# Altium schematic sheet Main.SchDoc
size A3; Author: ALP Electronics; CompanyName: ALP Electronics; DrawnBy: Caner Alp; Engineer: Caner Alp; Organization: ALP Electronics; Address2: Västerås; Address4: Sweden; SheetNumber: 1; SheetTotal: 3
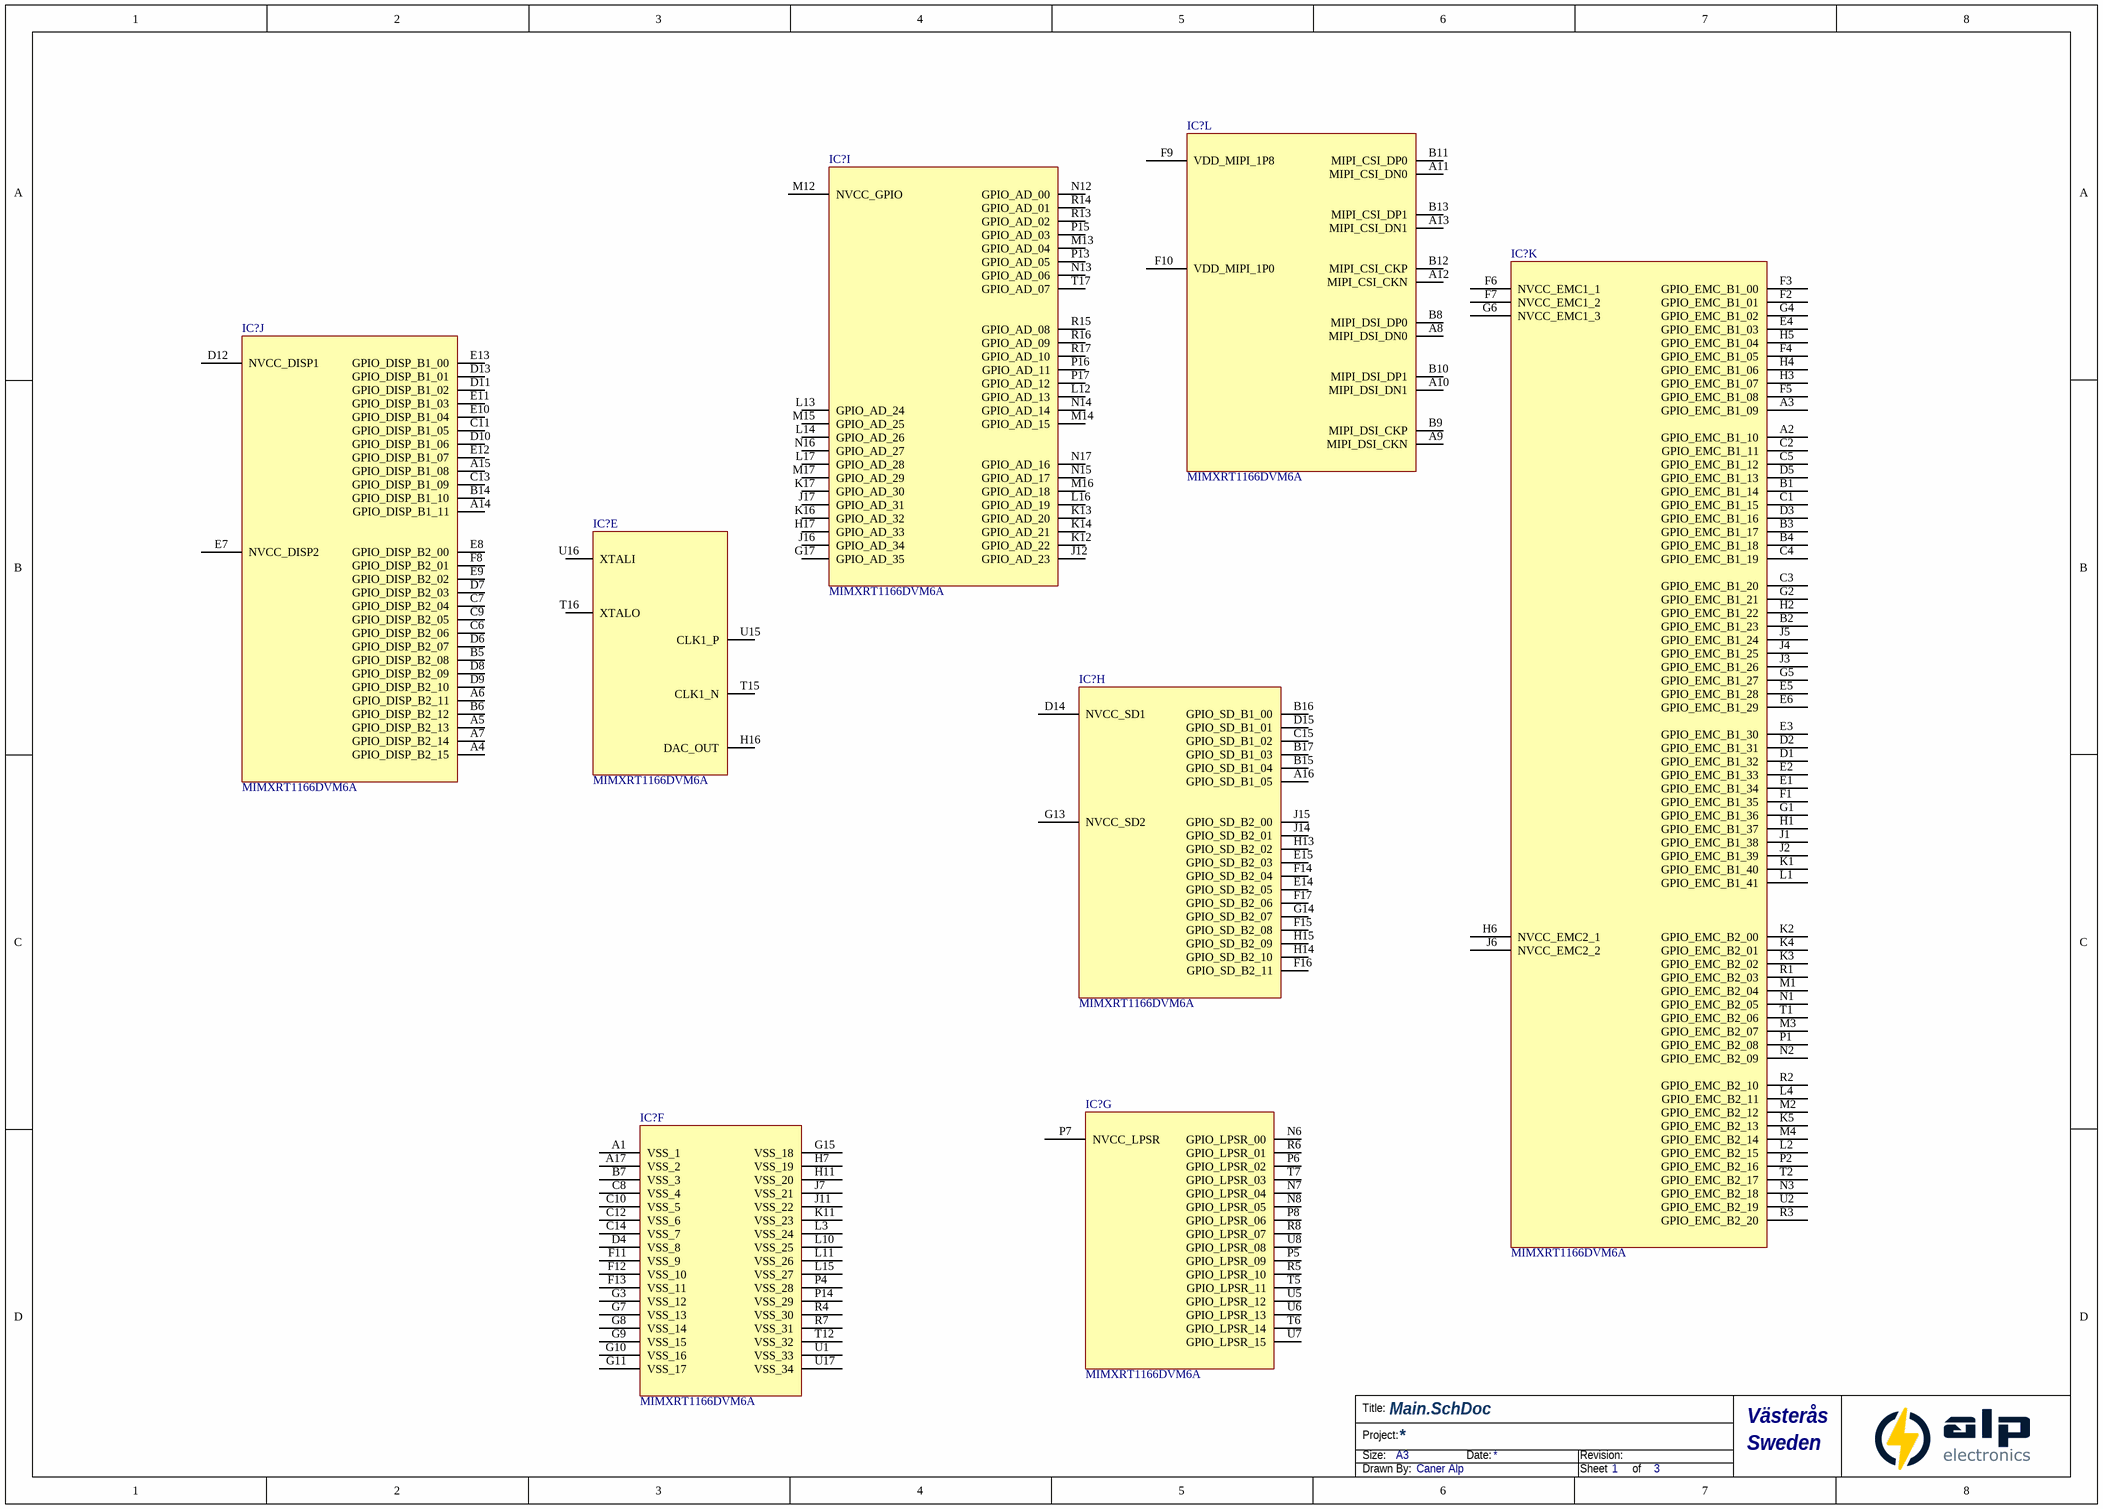
[diagram p0: Main.SchDoc]

## Parts
(Parts that share a designator on the sheet are numbered #1, #2 ... from top to bottom, then left to right.)
IC?#1  MIMXRT1166DVM6A  [BGA289C80P17X17_1400X1400X152]  (part L of 12)
IC?#2  MIMXRT1166DVM6A  [BGA289C80P17X17_1400X1400X152]  (part I of 12)
IC?#3  MIMXRT1166DVM6A  [BGA289C80P17X17_1400X1400X152]  (part K of 12)
IC?#4  MIMXRT1166DVM6A  [BGA289C80P17X17_1400X1400X152]  (part J of 12)
IC?#5  MIMXRT1166DVM6A  [BGA289C80P17X17_1400X1400X152]  (part E of 12)
IC?#6  MIMXRT1166DVM6A  [BGA289C80P17X17_1400X1400X152]  (part H of 12)
IC?#7  MIMXRT1166DVM6A  [BGA289C80P17X17_1400X1400X152]  (part G of 12)
IC?#8  MIMXRT1166DVM6A  [BGA289C80P17X17_1400X1400X152]  (part F of 12)

## Nets

Not connected (* = marked no-connect by the designer): IC?#1 A8(MIPI_DSI_DN0) A9(MIPI_DSI_CKN) A10(MIPI_DSI_DN1) A11(MIPI_CSI_DN0) A12(MIPI_CSI_CKN) A13(MIPI_CSI_DN1) B8(MIPI_DSI_DP0) B9(MIPI_DSI_CKP) B10(MIPI_DSI_DP1) B11(MIPI_CSI_DP0) B12(MIPI_CSI_CKP) B13(MIPI_CSI_DP1) F9(VDD_MIPI_1P8) F10(VDD_MIPI_1P0); IC?#2 G17(GPIO_AD_35) H17(GPIO_AD_33) J12(GPIO_AD_23) J16(GPIO_AD_34) J17(GPIO_AD_31) K12(GPIO_AD_22) K13(GPIO_AD_20) K14(GPIO_AD_21) K16(GPIO_AD_32) K17(GPIO_AD_30) L12(GPIO_AD_13) L13(GPIO_AD_24) L14(GPIO_AD_26) L16(GPIO_AD_19) L17(GPIO_AD_28) M12(NVCC_GPIO) M13(GPIO_AD_04) M14(GPIO_AD_15) M15(GPIO_AD_25) M16(GPIO_AD_18) M17(GPIO_AD_29) N12(GPIO_AD_00) N13(GPIO_AD_06) N14(GPIO_AD_14) N15(GPIO_AD_17) N16(GPIO_AD_27) N17(GPIO_AD_16) P13(GPIO_AD_05) P15(GPIO_AD_03) P16(GPIO_AD_11) P17(GPIO_AD_12) R13(GPIO_AD_02) R14(GPIO_AD_01) R15(GPIO_AD_08) R16(GPIO_AD_09) R17(GPIO_AD_10) T17(GPIO_AD_07); IC?#3 A2(GPIO_EMC_B1_10) A3(GPIO_EMC_B1_09) B1(GPIO_EMC_B1_14) B2(GPIO_EMC_B1_23) B3(GPIO_EMC_B1_17) B4(GPIO_EMC_B1_18) C1(GPIO_EMC_B1_15) C2(GPIO_EMC_B1_11) C3(GPIO_EMC_B1_20) C4(GPIO_EMC_B1_19) C5(GPIO_EMC_B1_12) D1(GPIO_EMC_B1_32) D2(GPIO_EMC_B1_31) D3(GPIO_EMC_B1_16) D5(GPIO_EMC_B1_13) E1(GPIO_EMC_B1_34) E2(GPIO_EMC_B1_33) E3(GPIO_EMC_B1_30) E4(GPIO_EMC_B1_03) E5(GPIO_EMC_B1_28) E6(GPIO_EMC_B1_29) F1(GPIO_EMC_B1_35) F2(GPIO_EMC_B1_01) F3(GPIO_EMC_B1_00) F4(GPIO_EMC_B1_05) F5(GPIO_EMC_B1_08) F6(NVCC_EMC1_1) F7(NVCC_EMC1_2) G1(GPIO_EMC_B1_36) G2(GPIO_EMC_B1_21) G4(GPIO_EMC_B1_02) G5(GPIO_EMC_B1_27) G6(NVCC_EMC1_3) H1(GPIO_EMC_B1_37) H2(GPIO_EMC_B1_22) H3(GPIO_EMC_B1_07) H4(GPIO_EMC_B1_06) H5(GPIO_EMC_B1_04) H6(NVCC_EMC2_1) J1(GPIO_EMC_B1_38) J2(GPIO_EMC_B1_39) J3(GPIO_EMC_B1_26) J4(GPIO_EMC_B1_25) J5(GPIO_EMC_B1_24) J6(NVCC_EMC2_2) K1(GPIO_EMC_B1_40) K2(GPIO_EMC_B2_00) K3(GPIO_EMC_B2_02) K4(GPIO_EMC_B2_01) K5(GPIO_EMC_B2_13) L1(GPIO_EMC_B1_41) L2(GPIO_EMC_B2_15) L4(GPIO_EMC_B2_11) M1(GPIO_EMC_B2_04) M2(GPIO_EMC_B2_12) M3(GPIO_EMC_B2_07) M4(GPIO_EMC_B2_14) N1(GPIO_EMC_B2_05) N2(GPIO_EMC_B2_09) N3(GPIO_EMC_B2_18) P1(GPIO_EMC_B2_08) P2(GPIO_EMC_B2_16) R1(GPIO_EMC_B2_03) R2(GPIO_EMC_B2_10) R3(GPIO_EMC_B2_20) T1(GPIO_EMC_B2_06) T2(GPIO_EMC_B2_17) U2(GPIO_EMC_B2_19); IC?#4 A4(GPIO_DISP_B2_15) A5(GPIO_DISP_B2_13) A6(GPIO_DISP_B2_11) A7(GPIO_DISP_B2_14) A14(GPIO_DISP_B1_11) A15(GPIO_DISP_B1_08) B5(GPIO_DISP_B2_08) B6(GPIO_DISP_B2_12) B14(GPIO_DISP_B1_10) C6(GPIO_DISP_B2_06) C7(GPIO_DISP_B2_04) C9(GPIO_DISP_B2_05) C11(GPIO_DISP_B1_05) C13(GPIO_DISP_B1_09) D6(GPIO_DISP_B2_07) D7(GPIO_DISP_B2_03) D8(GPIO_DISP_B2_09) D9(GPIO_DISP_B2_10) D10(GPIO_DISP_B1_06) D11(GPIO_DISP_B1_02) D12(NVCC_DISP1) D13(GPIO_DISP_B1_01) E7(NVCC_DISP2) E8(GPIO_DISP_B2_00) E9(GPIO_DISP_B2_02) E10(GPIO_DISP_B1_04) E11(GPIO_DISP_B1_03) E12(GPIO_DISP_B1_07) E13(GPIO_DISP_B1_00) F8(GPIO_DISP_B2_01); IC?#5 H16(DAC_OUT) T15(CLK1_N) T16(XTALO) U15(CLK1_P) U16(XTALI); IC?#6 A16(GPIO_SD_B1_05) B15(GPIO_SD_B1_04) B16(GPIO_SD_B1_00) B17(GPIO_SD_B1_03) C15(GPIO_SD_B1_02) D14(NVCC_SD1) D15(GPIO_SD_B1_01) E14(GPIO_SD_B2_05) E15(GPIO_SD_B2_03) F14(GPIO_SD_B2_04) F15(GPIO_SD_B2_08) F16(GPIO_SD_B2_11) F17(GPIO_SD_B2_06) G13(NVCC_SD2) G14(GPIO_SD_B2_07) H13(GPIO_SD_B2_02) H14(GPIO_SD_B2_10) H15(GPIO_SD_B2_09) J14(GPIO_SD_B2_01) J15(GPIO_SD_B2_00); IC?#7 N6(GPIO_LPSR_00) N7(GPIO_LPSR_04) N8(GPIO_LPSR_05) P5(GPIO_LPSR_09) P6(GPIO_LPSR_02) P7(NVCC_LPSR) P8(GPIO_LPSR_06) R5(GPIO_LPSR_10) R6(GPIO_LPSR_01) R8(GPIO_LPSR_07) T5(GPIO_LPSR_11) T6(GPIO_LPSR_14) T7(GPIO_LPSR_03) U5(GPIO_LPSR_12) U6(GPIO_LPSR_13) U7(GPIO_LPSR_15) U8(GPIO_LPSR_08); IC?#8 A1(VSS_1) A17(VSS_2) B7(VSS_3) C8(VSS_4) C10(VSS_5) C12(VSS_6) C14(VSS_7) D4(VSS_8) F11(VSS_9) F12(VSS_10) F13(VSS_11) G3(VSS_12) G7(VSS_13) G8(VSS_14) G9(VSS_15) G10(VSS_16) G11(VSS_17) G15(VSS_18) H7(VSS_19) H11(VSS_20) J7(VSS_21) J11(VSS_22) K11(VSS_23) L3(VSS_24) L10(VSS_25) L11(VSS_26) L15(VSS_27) P4(VSS_28) P14(VSS_29) R4(VSS_30) R7(VSS_31) T12(VSS_32) U1(VSS_33) U17(VSS_34)

## Notes on the sheet
- Title:
- Size:
- Project:
- A3
- Date:
- Revision:
- Drawn By:
- Sheet
- of

## Library data of the parts
IC?#1-IC?#8 = MIMXRT1166DVM6A: Integrated Circuit; Manufacturer_Name: NXP; Datasheet Link: https://www.mouser.in/datasheet/2/302/IMXRT1160CEC-2335852.pdf; Height: 1.52mm; Manufacturer_Part_Number: MIMXRT1166DVM6A; Mouser Part Number: 771-MIMXRT1166DVM6A; Mouser Price/Stock: https://www.mouser.co.uk/ProductDetail/NXP-Semiconductors/MIMXRT1166DVM6A?qs=DRkmTr78QARbPfoaiaD1vg%3D%3D